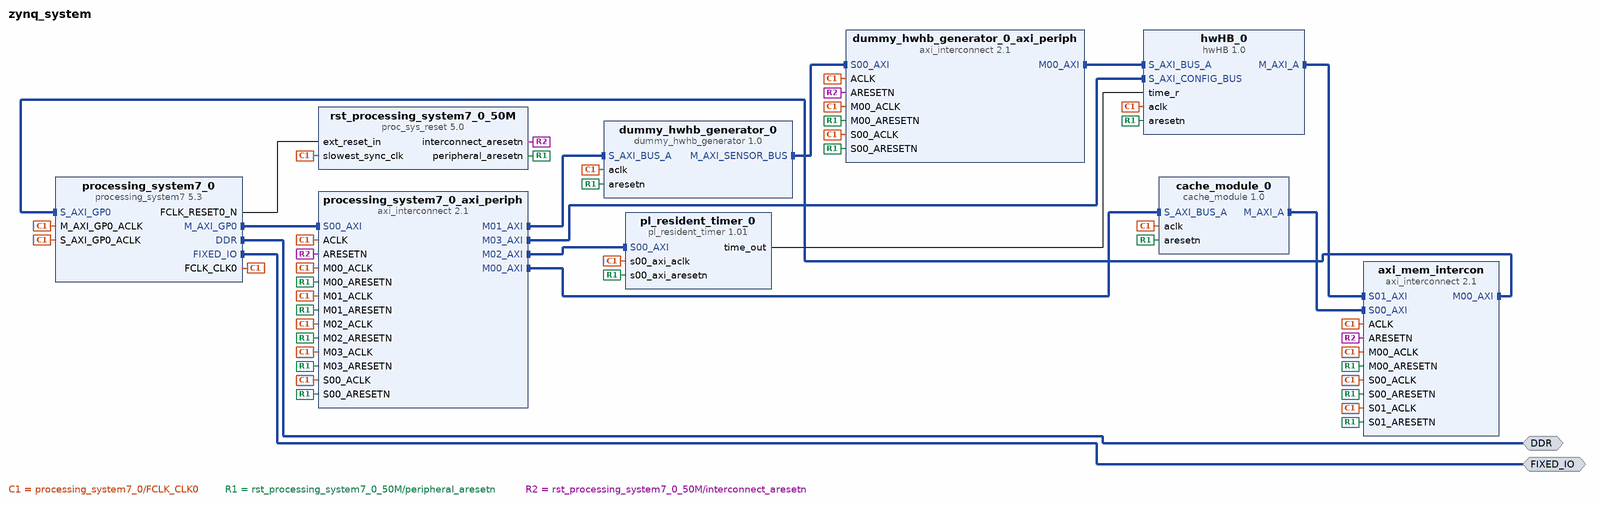
[diagram p0: block diagram of the top level]
# Vivado block design zynq_system, Vivado 2013.4
create_bd_design zynq_system

create_bd_intf_port -mode Master -vlnv xilinx.com:interface:ddrx_rtl:1.0 DDR
create_bd_intf_port -mode Master -vlnv xilinx.com:display_processing_system7:fixedio_rtl:1.0 FIXED_IO

create_bd_cell -type ip -vlnv xilinx.com:ip:processing_system7:5.3 processing_system7_0
set_property -dict {CONFIG.PCW_USE_S_AXI_GP0 1 CONFIG.preset {ZC702*}} [get_bd_cells processing_system7_0]
create_bd_cell -type ip -vlnv xilinx.com:ip:axi_interconnect:2.1 axi_mem_intercon
set_property -dict {CONFIG.NUM_SI 2 CONFIG.NUM_MI 1} [get_bd_cells axi_mem_intercon]
create_bd_cell -type ip -vlnv xilinx.com:ip:proc_sys_reset:5.0 rst_processing_system7_0_50M
create_bd_cell -type ip -vlnv xilinx.com:ip:axi_interconnect:2.1 processing_system7_0_axi_periph
set_property -dict {CONFIG.NUM_MI 4} [get_bd_cells processing_system7_0_axi_periph]
create_bd_cell -type ip -vlnv sfleming:HHB:cache_module:1.0 cache_module_0
create_bd_cell -type ip -vlnv sfleming:HHB:pl_resident_timer:1.01 pl_resident_timer_0
create_bd_cell -type ip -vlnv xilinx.com:ip:axi_interconnect:2.1 dummy_hwhb_generator_0_axi_periph
set_property -dict {CONFIG.NUM_MI 1} [get_bd_cells dummy_hwhb_generator_0_axi_periph]
create_bd_cell -type ip -vlnv sfleming:HHB:dummy_hwhb_generator:1.0 dummy_hwhb_generator_0
create_bd_cell -type ip -vlnv sfleming:HHB:hwHB:1.0 hwHB_0

# ---- connections ----

connect_bd_intf_net [get_bd_intf_pins cache_module_0/M_AXI_A] [get_bd_intf_pins axi_mem_intercon/S00_AXI]
connect_bd_intf_net [get_bd_intf_pins axi_mem_intercon/M00_AXI] [get_bd_intf_pins processing_system7_0/S_AXI_GP0]
connect_bd_intf_net [get_bd_intf_pins processing_system7_0/M_AXI_GP0] [get_bd_intf_pins processing_system7_0_axi_periph/S00_AXI]
connect_bd_intf_net [get_bd_intf_pins processing_system7_0_axi_periph/M00_AXI] [get_bd_intf_pins cache_module_0/S_AXI_BUS_A]
connect_bd_intf_net [get_bd_intf_pins hwHB_0/M_AXI_A] [get_bd_intf_pins axi_mem_intercon/S01_AXI]
connect_bd_intf_net [get_bd_intf_pins processing_system7_0_axi_periph/M02_AXI] [get_bd_intf_pins pl_resident_timer_0/S00_AXI]
connect_bd_intf_net [get_bd_intf_pins dummy_hwhb_generator_0/M_AXI_SENSOR_BUS] [get_bd_intf_pins dummy_hwhb_generator_0_axi_periph/S00_AXI]
connect_bd_intf_net [get_bd_intf_pins dummy_hwhb_generator_0_axi_periph/M00_AXI] [get_bd_intf_pins hwHB_0/S_AXI_BUS_A]
connect_bd_intf_net [get_bd_intf_pins processing_system7_0_axi_periph/M01_AXI] [get_bd_intf_pins dummy_hwhb_generator_0/S_AXI_BUS_A]
connect_bd_intf_net [get_bd_intf_pins processing_system7_0_axi_periph/M03_AXI] [get_bd_intf_pins hwHB_0/S_AXI_CONFIG_BUS]
connect_bd_intf_net [get_bd_intf_ports DDR] [get_bd_intf_pins processing_system7_0/DDR]
connect_bd_intf_net [get_bd_intf_ports FIXED_IO] [get_bd_intf_pins processing_system7_0/FIXED_IO]
connect_bd_net [get_bd_pins processing_system7_0/FCLK_CLK0] \
  [get_bd_pins processing_system7_0/M_AXI_GP0_ACLK] [get_bd_pins processing_system7_0/S_AXI_GP0_ACLK] \
  [get_bd_pins axi_mem_intercon/S00_ACLK] [get_bd_pins rst_processing_system7_0_50M/slowest_sync_clk] \
  [get_bd_pins axi_mem_intercon/ACLK] [get_bd_pins axi_mem_intercon/M00_ACLK] \
  [get_bd_pins processing_system7_0_axi_periph/S00_ACLK] [get_bd_pins processing_system7_0_axi_periph/ACLK] \
  [get_bd_pins processing_system7_0_axi_periph/M00_ACLK] [get_bd_pins processing_system7_0_axi_periph/M01_ACLK] \
  [get_bd_pins axi_mem_intercon/S01_ACLK] [get_bd_pins processing_system7_0_axi_periph/M02_ACLK] \
  [get_bd_pins cache_module_0/aclk] [get_bd_pins pl_resident_timer_0/s00_axi_aclk] \
  [get_bd_pins dummy_hwhb_generator_0_axi_periph/S00_ACLK] [get_bd_pins dummy_hwhb_generator_0_axi_periph/ACLK] \
  [get_bd_pins dummy_hwhb_generator_0_axi_periph/M00_ACLK] [get_bd_pins dummy_hwhb_generator_0/aclk] \
  [get_bd_pins processing_system7_0_axi_periph/M03_ACLK] [get_bd_pins hwHB_0/aclk]
connect_bd_net [get_bd_pins processing_system7_0/FCLK_RESET0_N] [get_bd_pins rst_processing_system7_0_50M/ext_reset_in]
connect_bd_net [get_bd_pins rst_processing_system7_0_50M/peripheral_aresetn] \
  [get_bd_pins axi_mem_intercon/S00_ARESETN] [get_bd_pins axi_mem_intercon/M00_ARESETN] \
  [get_bd_pins processing_system7_0_axi_periph/S00_ARESETN] [get_bd_pins processing_system7_0_axi_periph/M00_ARESETN] \
  [get_bd_pins processing_system7_0_axi_periph/M01_ARESETN] [get_bd_pins axi_mem_intercon/S01_ARESETN] \
  [get_bd_pins processing_system7_0_axi_periph/M02_ARESETN] [get_bd_pins cache_module_0/aresetn] \
  [get_bd_pins pl_resident_timer_0/s00_axi_aresetn] [get_bd_pins dummy_hwhb_generator_0_axi_periph/S00_ARESETN] \
  [get_bd_pins dummy_hwhb_generator_0_axi_periph/M00_ARESETN] [get_bd_pins dummy_hwhb_generator_0/aresetn] \
  [get_bd_pins processing_system7_0_axi_periph/M03_ARESETN] [get_bd_pins hwHB_0/aresetn]
connect_bd_net [get_bd_pins rst_processing_system7_0_50M/interconnect_aresetn] \
  [get_bd_pins axi_mem_intercon/ARESETN] [get_bd_pins processing_system7_0_axi_periph/ARESETN] \
  [get_bd_pins dummy_hwhb_generator_0_axi_periph/ARESETN]
connect_bd_net [get_bd_pins pl_resident_timer_0/time_out] [get_bd_pins hwHB_0/time_r]

# ---- address map ----
assign_bd_address -offset 0x00000000 -range 1G -target_address_space [get_bd_addr_spaces cache_module_0/Data] [get_bd_addr_segs processing_system7_0/S_AXI_GP0/GP0_DDR_LOWOCM]
assign_bd_address -offset 0xE0000000 -range 4M -target_address_space [get_bd_addr_spaces cache_module_0/Data] [get_bd_addr_segs processing_system7_0/S_AXI_GP0/GP0_IOP]
assign_bd_address -offset 0xFC000000 -range 16M -target_address_space [get_bd_addr_spaces cache_module_0/Data] [get_bd_addr_segs processing_system7_0/S_AXI_GP0/GP0_QSPI_LINEAR]
assign_bd_address -offset 0x44A00000 -range 64K -target_address_space [get_bd_addr_spaces dummy_hwhb_generator_0/Data] [get_bd_addr_segs hwHB_0/S_AXI_BUS_A/Reg]
assign_bd_address -offset 0x00000000 -range 1G -target_address_space [get_bd_addr_spaces hwHB_0/Data] [get_bd_addr_segs processing_system7_0/S_AXI_GP0/GP0_DDR_LOWOCM]
assign_bd_address -offset 0xE0000000 -range 4M -target_address_space [get_bd_addr_spaces hwHB_0/Data] [get_bd_addr_segs processing_system7_0/S_AXI_GP0/GP0_IOP]
assign_bd_address -offset 0xFC000000 -range 16M -target_address_space [get_bd_addr_spaces hwHB_0/Data] [get_bd_addr_segs processing_system7_0/S_AXI_GP0/GP0_QSPI_LINEAR]
assign_bd_address -offset 0x43C00000 -range 64K -target_address_space [get_bd_addr_spaces processing_system7_0/Data] [get_bd_addr_segs cache_module_0/S_AXI_BUS_A/Reg]
assign_bd_address -offset 0x43C10000 -range 64K -target_address_space [get_bd_addr_spaces processing_system7_0/Data] [get_bd_addr_segs dummy_hwhb_generator_0/S_AXI_BUS_A/Reg]
assign_bd_address -offset 0x43C20000 -range 4K -target_address_space [get_bd_addr_spaces processing_system7_0/Data] [get_bd_addr_segs pl_resident_timer_0/S00_AXI/S00_AXI_reg]
assign_bd_address -offset 0x43C30000 -range 64K -target_address_space [get_bd_addr_spaces processing_system7_0/Data] [get_bd_addr_segs hwHB_0/S_AXI_CONFIG_BUS/Reg]

validate_bd_design
save_bd_design
